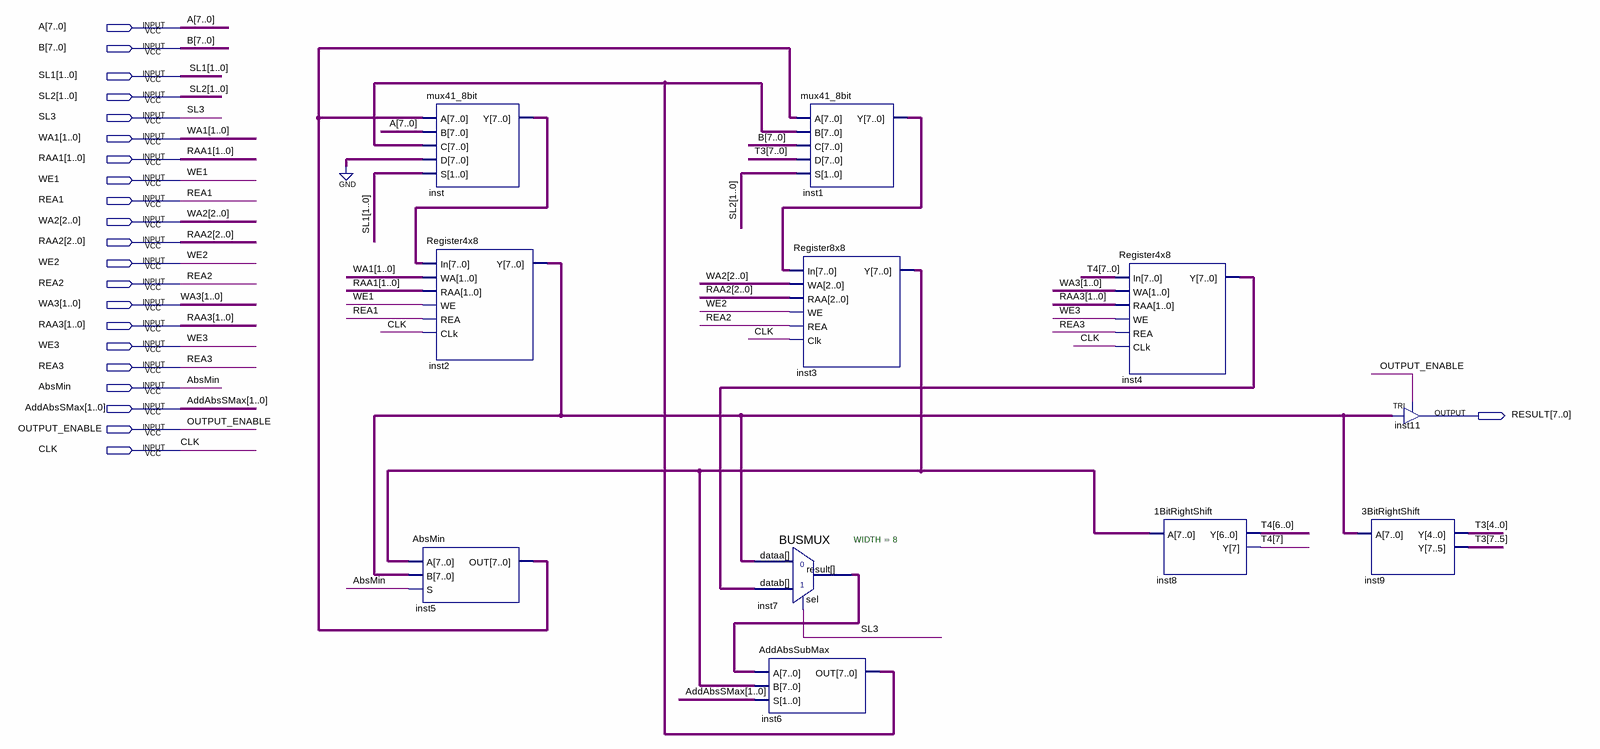
[diagram p0: schematic sheet]
// Quartus schematic DATAPATH_DC.bdf as structural Verilog: 11 symbols, 22 pins
module DATAPATH_DC (
  input  [7:0] A,
  input  [7:0] B,
  input  [1:0] SL1,
  input  [1:0] SL2,
  input  SL3,
  input  [1:0] WA1,
  input  [1:0] RAA1,
  input  WE1,
  input  REA1,
  input  [2:0] WA2,
  input  [2:0] RAA2,
  input  WE2,
  input  REA2,
  input  [1:0] WA3,
  input  [1:0] RAA3,
  input  WE3,
  input  REA3,
  input  AbsMin,
  input  [1:0] AddAbsSMax,
  input  OUTPUT_ENABLE,
  input  CLK,
  output [7:0] RESULT
);

  wire [7:0] inst1_y, inst2_y, inst3_y, inst4_y, inst5_out, inst6_out, inst7_result, inst_y, T3, T4;

  mux41_8bit inst (.A(inst5_out), .B(A), .C(inst6_out), .D({8{1'b0}}), .S(SL1), .Y(inst_y));
  Register4x8 inst2 (.In(inst_y), .WA(WA1), .RAA(RAA1), .WE(WE1), .REA(REA1), .CLk(CLK), .Y(inst2_y));
  AbsMin inst5 (.A(inst3_y), .B(inst2_y), .S(AbsMin), .OUT(inst5_out));
  BUSMUX #(.WIDTH(8)) inst7 (.datab(inst4_y), .sel(SL3), .dataa(inst2_y), .result(inst7_result));
  AddAbsSubMax inst6 (.A(inst7_result), .B(inst3_y), .S(AddAbsSMax), .OUT(inst6_out));
  mux41_8bit inst1 (.A(inst5_out), .B(inst6_out), .C(B), .D(T3), .S(SL2), .Y(inst1_y));
  Register8x8 inst3 (.In(inst1_y), .WA(WA2), .RAA(RAA2), .WE(WE2), .REA(REA2), .Clk(CLK), .Y(inst3_y));
  Register4x8 inst4 (.In(T4), .WA(WA3), .RAA(RAA3), .WE(WE3), .REA(REA3), .CLk(CLK), .Y(inst4_y));
  \1BitRightShift  inst8 (.A(inst3_y), .Y(T4));
  TRI inst11[7:0] (.IN(inst2_y), .OE(OUTPUT_ENABLE), .OUT(RESULT));
  \3BitRightShift  inst9 (.A(inst2_y), .Y(T3));
endmodule
